# EAGLE design scorbot_jcb (EAGLE 7.4.0)
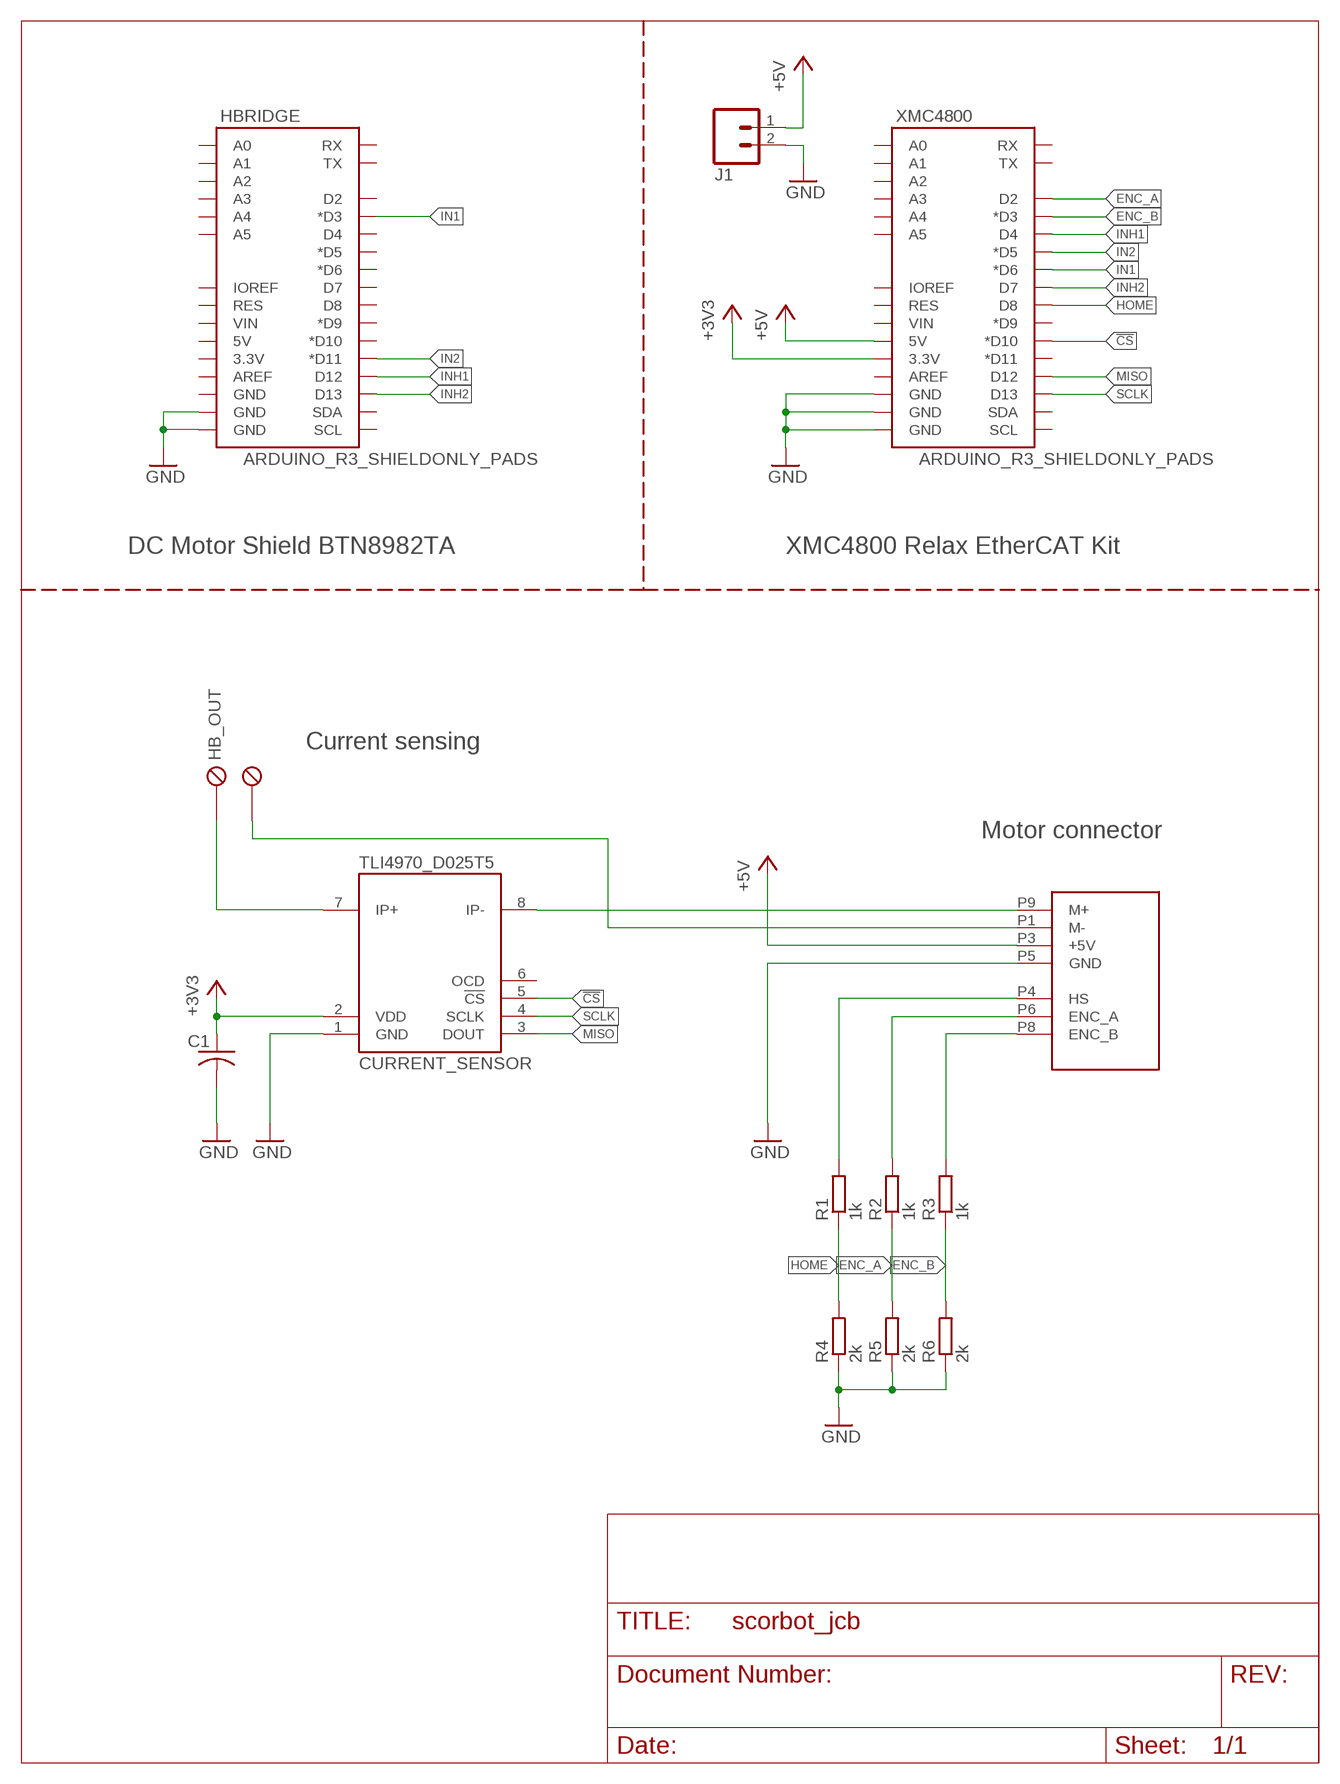
[diagram p0: schematic, sheet 1]

## Parts
C1  C-US025-025X050  [C025-025X050]
CURRENT_SENSOR  TLI4970_D025T5  [TLI4970_D025T5]
DB9  SCORBOT_CONNECTOR  [XM3-LS]
HB_OUT  METALTEX-2SHORT  [METALTEX-2S]
HBRIDGE  ARDUINO_R3_SHIELDONLY_PADS  [UNO_R3_SHIELD_ONLY_PADS]
J1  M02LOCK_LONGPADS  [1X02_LOCK_LONGPADS]
R1  1k  R-EU_0309/12  [0309/12]
R2  1k  R-EU_0309/12  [0309/12]
R3  1k  R-EU_0309/12  [0309/12]
R4  2k  R-EU_0309/12  [0309/12]
R5  2k  R-EU_0309/12  [0309/12]
R6  2k  R-EU_0309/12  [0309/12]
XMC4800  ARDUINO_R3_SHIELDONLY_PADS  [UNO_R3_SHIELD_ONLY_PADS]

## Nets
!CS: CURRENT_SENSOR.5(!CS) XMC4800.D10(*D10)
+3V3: C1.1 CURRENT_SENSOR.2(VDD) XMC4800.3.3V
+5V: DB9.P3(+5V) J1.1 XMC4800.5V
ENC_A: R2.1 R5.2 XMC4800.D2
ENC_B: R3.1 R6.2 XMC4800.D3(*D3)
GND: C1.2 CURRENT_SENSOR.1(GND) DB9.P5(GND) HBRIDGE.GND@0(GND) HBRIDGE.GND@1(GND) J1.2 R4.1 R5.1 R6.1 XMC4800.GND@0(GND) XMC4800.GND@1(GND) XMC4800.GND@2(GND)
HOME: R1.1 R4.2 XMC4800.D8
IN1: HBRIDGE.D3(*D3) XMC4800.D6(*D6)
IN2: HBRIDGE.D11(*D11) XMC4800.D5(*D5)
INH1: HBRIDGE.D12 XMC4800.D4
INH2: HBRIDGE.D13 XMC4800.D7
MISO: CURRENT_SENSOR.3(DOUT) XMC4800.D12
N$1: CURRENT_SENSOR.8(IP-) DB9.P9(M+)
N$2: CURRENT_SENSOR.7(IP+) HB_OUT.P1
N$3: DB9.P1(M-) HB_OUT.P2
N$9: DB9.P4(HS) R1.2
N$10: DB9.P6(ENC_A) R2.2
N$11: DB9.P8(ENC_B) R3.2
SCLK: CURRENT_SENSOR.4(SCLK) XMC4800.D13
Unconnected: CURRENT_SENSOR.6(OCD) HBRIDGE.3.3V HBRIDGE.5V HBRIDGE.A0 HBRIDGE.A1 HBRIDGE.A2 HBRIDGE.A3 HBRIDGE.A4 HBRIDGE.A5 HBRIDGE.AREF HBRIDGE.D2 HBRIDGE.D4 HBRIDGE.D5(*D5) HBRIDGE.D6(*D6) HBRIDGE.D7 HBRIDGE.D8 HBRIDGE.D9(*D9) HBRIDGE.D10(*D10) HBRIDGE.GND@2(GND) HBRIDGE.IOREF HBRIDGE.RES HBRIDGE.RX HBRIDGE.SCL HBRIDGE.SDA HBRIDGE.TX HBRIDGE.VIN XMC4800.A0 XMC4800.A1 XMC4800.A2 XMC4800.A3 XMC4800.A4 XMC4800.A5 XMC4800.AREF XMC4800.D9(*D9) XMC4800.D11(*D11) XMC4800.IOREF XMC4800.RES XMC4800.RX XMC4800.SCL XMC4800.SDA XMC4800.TX XMC4800.VIN

## Notes on the sheet
- DC Motor Shield BTN8982TA | XMC4800 Relax EtherCAT Kit
- Current sensing
- Motor connector

## Library data of the parts
C1 = rcl:C-US: CAPACITOR, American symbol
CURRENT_SENSOR = uchile_robotics_eagle_lib:TLI4970_D025T5: TLI4970-D025T5 Miniature coreless magnetic current sensor for AC and DC measurements with digital interface and fast overcurrent detection.
DB9 = uchile_robotics_eagle_lib:SCORBOT_CONNECTOR: D9 Connector for Scorbot ERVII
HB_OUT = uchile_robotics_eagle_lib:METALTEX-2
HBRIDGE XMC4800 = uchile_robotics_eagle_lib:ARDUINO_R3_SHIELD: Shield form compatible with the Arduino Uno R3.
J1 = uchile_robotics_eagle_lib:M02: Standard 2-pin 0.1" header. Use with - straight break away headers ( PRT-00116) - right angle break away headers (PRT-00553) - swiss pins (PRT-00743) - machine pins (PRT-00117) - female headers (PRT-00115) Molex polarized connector foot print use with: PRT-08233 with associated crimp pins and housings. 2.54_SCREWTERM for use with PRT-10571. 3.5mm Screw Terminal footprints for PRT-08084 5mm Screw Terminal footprints for use with PRT-08432
R1-R6 = rcl:R-EU_: RESISTOR, European symbol

## Board
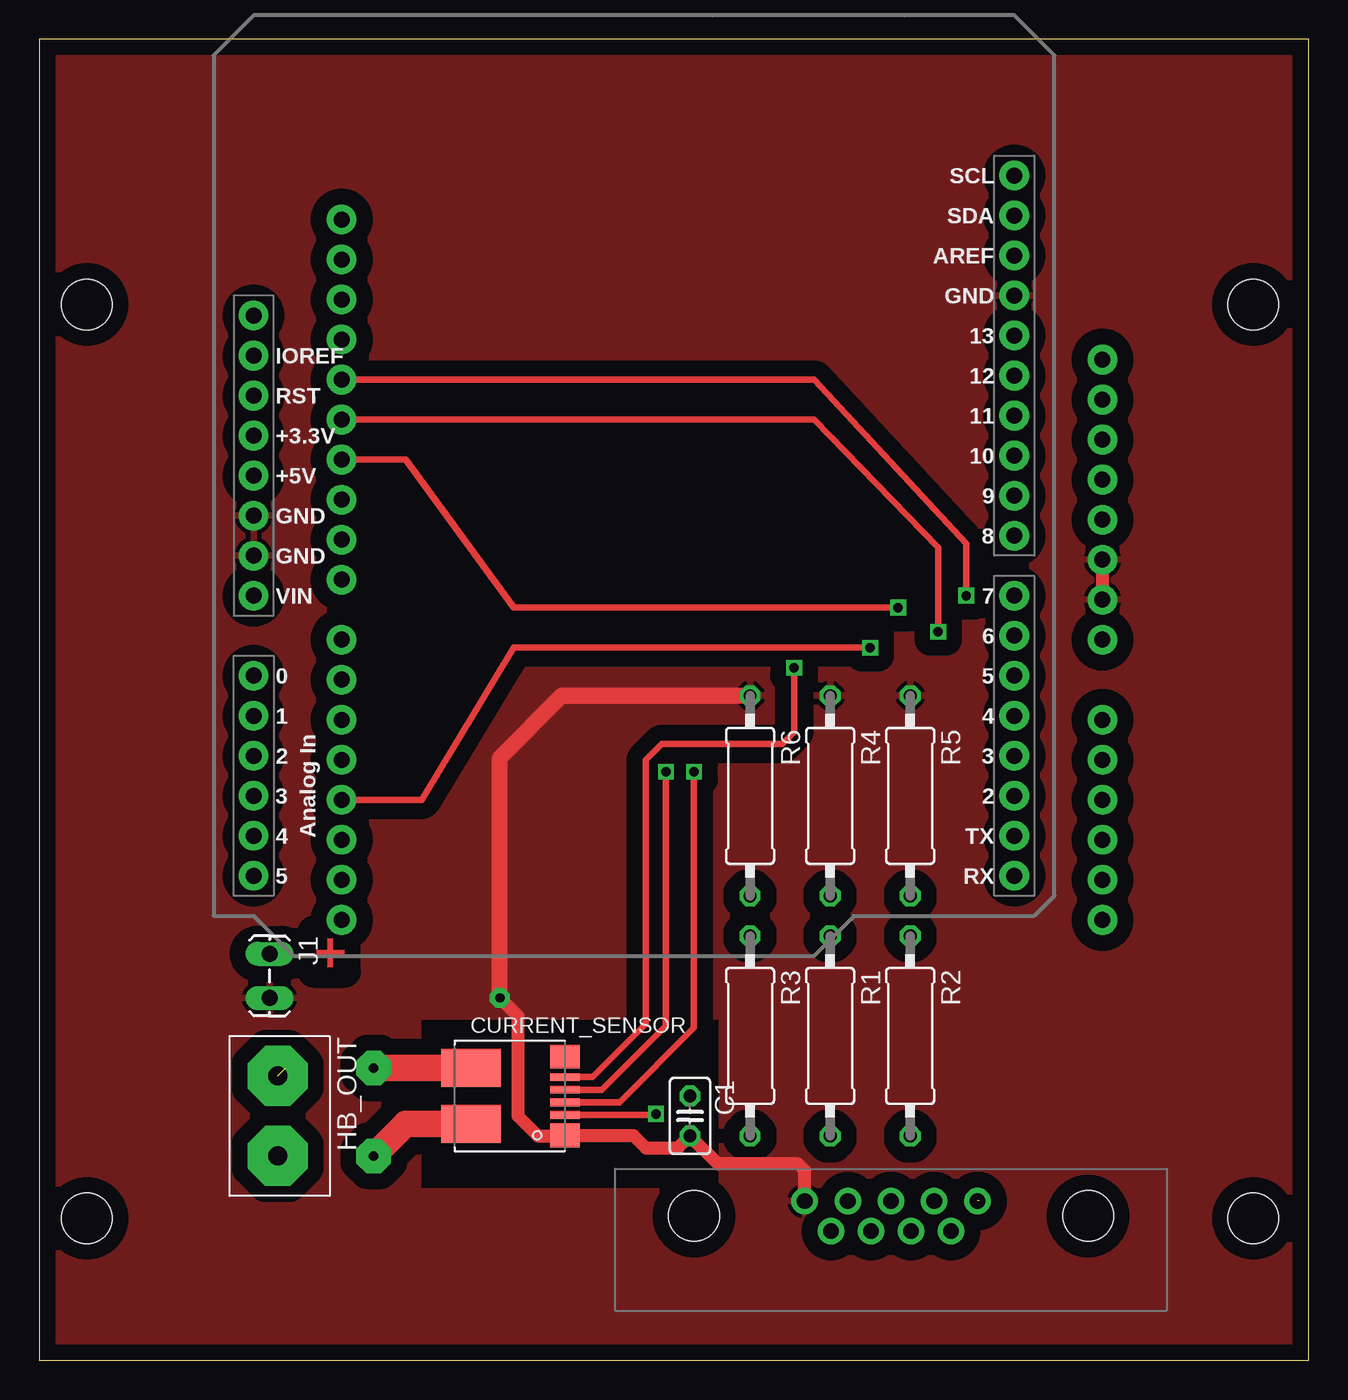
[diagram p1: board, top side]
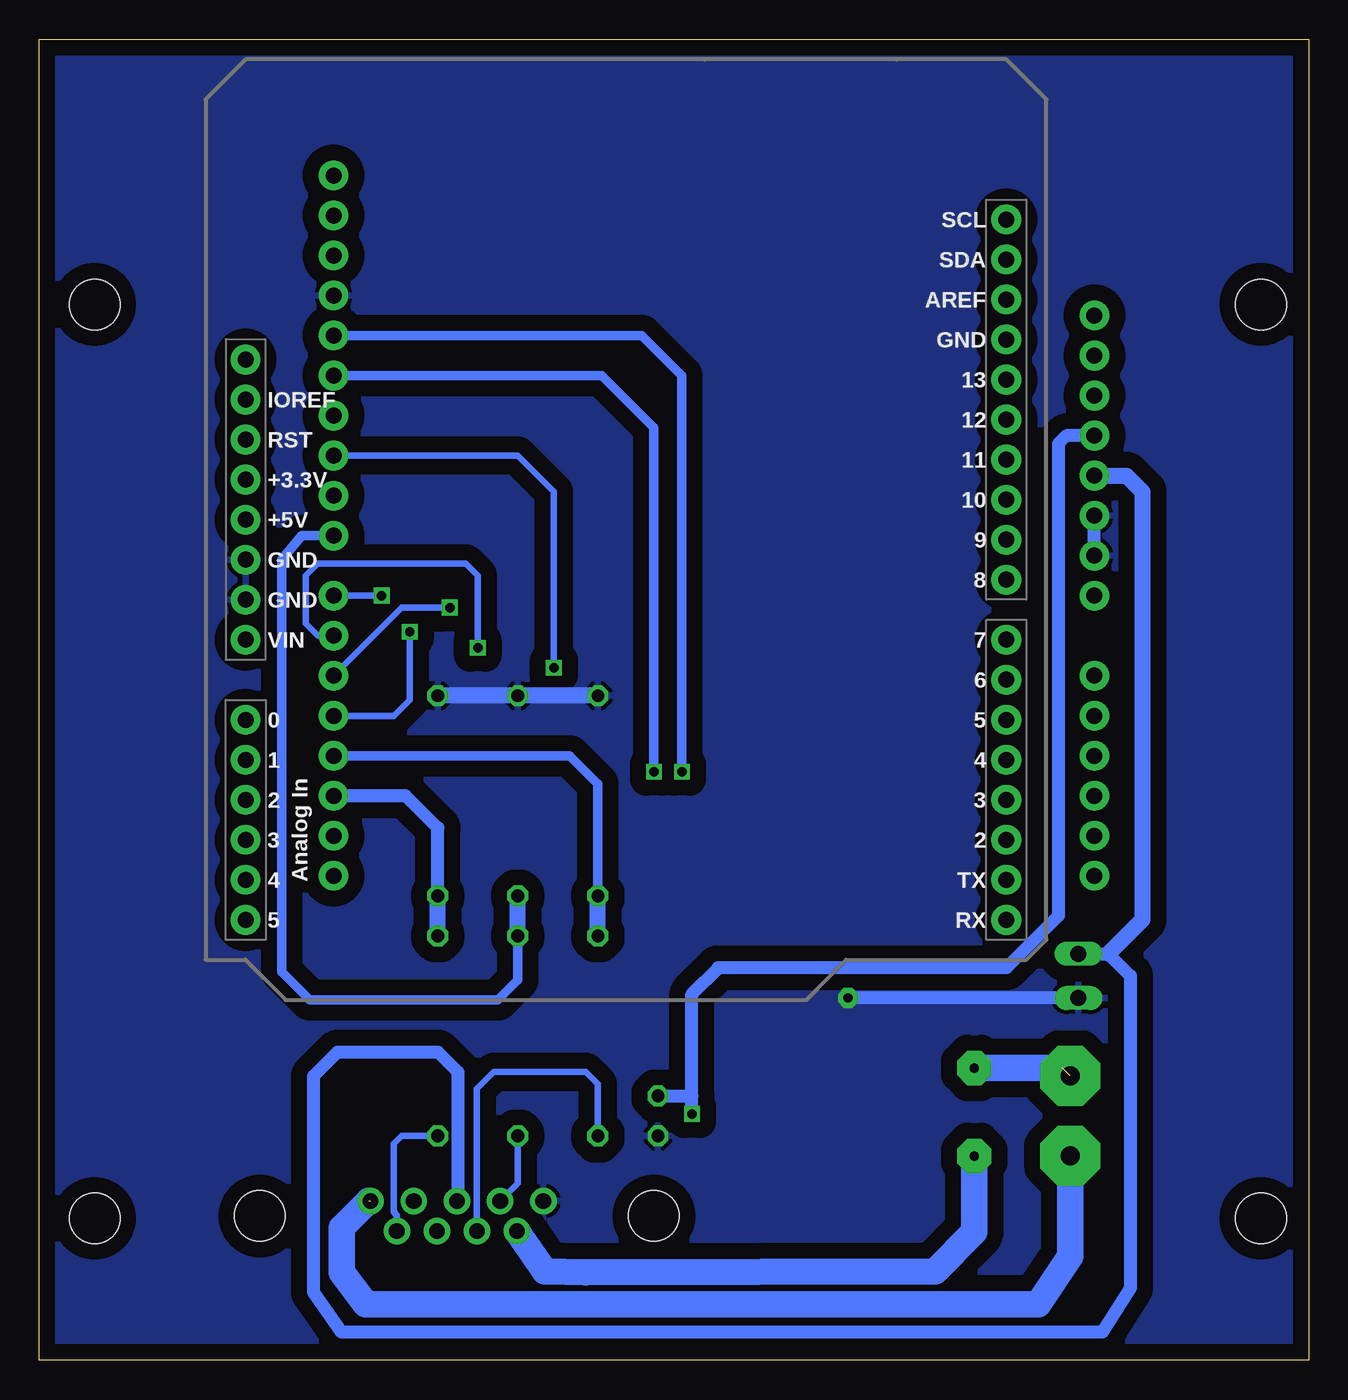
[diagram p2: board, bottom side, seen from below]

Size 80.52 x 83.82 mm. Coordinates in mm from the lower left corner, seen from the top.
Outline: 0,0 80.52,0 80.52,83.82 0,83.82 0,0
Copper layers (1*16): Top 0.035mm / dielectric 1.5mm / Bottom 0.035mm
Design rules "default *": minimum track width 10mil, minimum drill 20mil, track to track 8mil, track to pad 8mil, pad to pad 8mil, via to via 8mil, smd to smd 8mil, copper to edge 40mil, drill to drill 8mil, minimum pad ring 10mil, minimum via ring 8mil, stop-mask expansion 4mil, vias tented up to drill 0mil, thermal gap 10mil
Holes 3.2 mm at 3.02,67 3.02,9 77.02,9 77.02,67

### Footprints (pad centres in the part's own frame; a part is rotated, then mirrored left to right if it is on the bottom)
C025-025X050 = drill 0.813 octagon: 1 -1.27,0; 2 1.27,0
TLI4970_D025T5 = smd 1.5 x 1.9: 1 -2.5,-3.5; 6 2.5,-3.5 | smd 0.5 x 1.9: 2 -1.2,-3.5; 3 -0.4,-3.5; 4 0.4,-3.5; 5 1.2,-3.5 | smd 2.4 x 3.78: 7 1.78,2.47; 8 -1.78,2.47
XM3-LS = drill 1 pad 1.676: P1 17.98,0.953; P2 15.24,0.953; P3 12.5,0.953; P4 9.76,0.953; P5 7.02,0.953; P6 16.31,-0.953; P7 13.77,-0.953; P8 11.23,-0.953; P9 8.69,-0.953 | hole 3.2: 0,0; 25,0
METALTEX-2S = drill 1.2 pad 3.81 octagon: P1 -2.54,1.778; P2 2.54,1.778
UNO_R3_SHIELD_ONLY_PADS = drill 1.016 pad 1.88: 3.3V 50.8,26.67; 5V 50.8,29.21; A0 50.8,41.91; A1 50.8,44.45; A2 50.8,46.99; A3 50.8,49.53; A4 50.8,52.07; A5 50.8,54.61; AREF 2.54,15.24; D2 2.54,49.53; D3 2.54,46.99; D4 2.54,44.45; D5 2.54,41.91; D6 2.54,39.37; D7 2.54,36.83; D8 2.54,33.02; D9 2.54,30.48; D10 2.54,27.94; D11 2.54,25.4; D12 2.54,22.86; D13 2.54,20.32; GND@0 50.8,31.75; GND@1 50.8,34.29; GND@2 2.54,17.78; IOREF 50.8,21.59; NC 50.8,19.05; RES 50.8,24.13; RX 2.54,54.61; SCL 2.54,10.16; SDA 2.54,12.7; TX 2.54,52.07; VIN 50.8,36.83
1X02_LOCK_LONGPADS = drill 1.016 long: 1 -0.127,0; 2 2.667,0
0309/12 = drill 0.813 octagon: 1 -6.35,0; 2 6.35,0

### Placement (x,y rotation side)
C1  41.28,15.49 270 top
CURRENT_SENSOR  29.84,16.76 90 top
DB9  41.53,9.14 0 top
HB_OUT  13.33,15.49 270 top
HBRIDGE  16.64,82.55 180 bottom
J1  14.61,25.65 270 top
R1  50.17,20.57 270 top
R2  55.25,20.57 270 top
R3  45.08,20.57 270 top
R4  50.17,35.81 270 top
R5  55.25,35.81 270 top
R6  45.08,35.81 270 top
XMC4800  64.39,85.34 180 top

### Tracks (layer width: path | path; a pad name or v marks a point on that pad's centre or on a via)
!CS  (via drill 0.6)
  Top 0.406: CURRENT_SENSOR.5 35.11,17.96 38.48,21.34 38.48,38.1 39.5,39.12 47.12,39.12 47.88,39.88 v47.88,43.94
  Bottom 0.406: v47.88,43.94 47.88,55.12 50.17,57.4 XMC4800.D10
+3V3  (via drill 0.6)
  Top 0.406: CURRENT_SENSOR.2 39.06,15.56 v39.12,15.62
  Bottom 0.813: XMC4800.3.3V 15.37,58.67 15.88,58.17 15.88,28.19 19.18,24.89 37.47,24.89 39.12,23.24 39.12,16.76 | v39.12,15.62 39.12,16.76 | C1.1 39.12,16.76
+5V
  Bottom 0.813: DB9.P3 53.97,10.15 53.97,18.29 55.25,19.56 61.59,19.56 63.12,18.03 63.12,4.32 61.34,1.78 13.08,1.78 11.3,4.57 11.3,24.38 12.7,25.78 J1.1
  Bottom 1.016: XMC4800.5V 11.56,56.13 10.54,55.12 10.54,27.94 12.7,25.78
ENC_A
  Bottom 0.813: R5.2 55.25,33.78 57.28,35.81 XMC4800.D2
  Bottom 1.016: R2.1 R5.2
ENC_B
  Bottom 0.61: XMC4800.D3 46.86,38.35 45.08,36.58 R6.2
  Bottom 1.016: R3.1 R6.2
GND  (via drill 0.6 pad 1.27)
  Top 0.813: CURRENT_SENSOR.1 33.91,14.26 | 33.91,14.26 37.68,14.26 38.48,13.46 40.51,13.46 C1.2 43.05,12.45 48.13,12.45 48.55,12.03 DB9.P5 | v29.21,22.99 30.35,21.84 30.35,15.49 31.62,14.22 33.87,14.22 33.91,14.26 | HBRIDGE.GND@0 HBRIDGE.GND@1
  Top 1.016: v29.21,22.99 29.21,38.23 33.15,42.16 R6.1
  Bottom 0.813: J1.2 v29.21,22.99 | XMC4800.GND@1 XMC4800.GND@0
  Bottom 1.016: R6.1 R4.1 R5.1
  pour Bottom (isolate 1.016): -0.38,0 0.02,84.58 80.53,84.58 80.52,0
  pour Top (isolate 1.016): -0.25,-0.25 -0.24,84.84 80.79,84.84 80.9,-0.25
HOME
  Bottom 0.61: XMC4800.D8 63.88,52.32 65.15,50.8 65.15,24.64 63.37,22.86 51.44,22.86 50.17,24.13 R1.1
  Bottom 1.016: R1.1 R4.2
IN1  (via drill 0.6)
  Top 0.406: HBRIDGE.D3 24.26,35.56 30.1,45.21 v52.7,45.21
  Bottom 0.406: XMC4800.D6 62.86,45.97 63.63,46.74 63.63,49.78 62.86,50.55 53.47,50.55 52.7,49.78 v52.7,45.21
IN2  (via drill 0.6)
  Top 0.406: HBRIDGE.D11 23.24,57.15 30.1,47.75 v54.48,47.75
  Bottom 0.406: v54.48,47.75 57.53,47.75 XMC4800.D5
INH1  (via drill 0.6)
  Top 0.406: v57.02,46.23 57.02,51.56 49.15,59.69 HBRIDGE.D12
  Bottom 0.406: XMC4800.D4 58.04,40.89 57.02,41.91 v57.02,46.23
INH2  (via drill 0.6)
  Top 0.406: HBRIDGE.D13 49.15,62.23 58.8,51.82 v58.8,48.51
  Bottom 0.406: v58.8,48.51 XMC4800.D7
MISO  (via drill 0.6)
  Top 0.406: CURRENT_SENSOR.3 36.81,16.36 41.53,21.08 v41.53,37.34
  Bottom 0.61: XMC4800.D12 44.83,62.48 41.53,59.18 v41.53,37.34
N$1  (via drill 0.6 pad 2.18)
  Top 1.676: CURRENT_SENSOR.8 23.24,14.98 v21.21,12.95
  Bottom 1.676: DB9.P9 48.45,5.65 45.85,5.59 23.68,5.65 21.21,8.13 v21.21,12.95
N$2  (via drill 0.6 pad 2.18)  (1 unrouted)
  Top 1.676: CURRENT_SENSOR.7 v21.21,18.54
  Bottom 1.676: v21.21,18.54 15.62,18.54
N$3  (1 unrouted)
  Bottom 1.676: 59.63,10.1 61.34,8.38 61.34,5.59 59.82,3.56 17.14,3.56 15.11,6.6 HB_OUT.P2
N$5
  cutout Top: 24.26,21.59 43.05,21.59 43.05,10.92 24.26,10.92
N$9
  Bottom 0.406: R1.2 50.17,11.22 DB9.P4
N$10
  Bottom 0.406: DB9.P6 57.84,9.2 58.04,9.4 58.04,13.72 57.53,14.22 R2.2
N$11
  Bottom 0.406: DB9.P8 52.76,17.22 51.69,18.29 45.85,18.29 45.08,17.53 R3.2
SCLK  (via drill 0.6)
  Top 0.406: v39.75,37.34 39.75,21.21 35.69,17.14 33.36,17.14 CURRENT_SENSOR.4
  Bottom 0.61: XMC4800.D13 42.29,65.02 39.75,62.48 v39.75,37.34

### Text on the board
Top: +